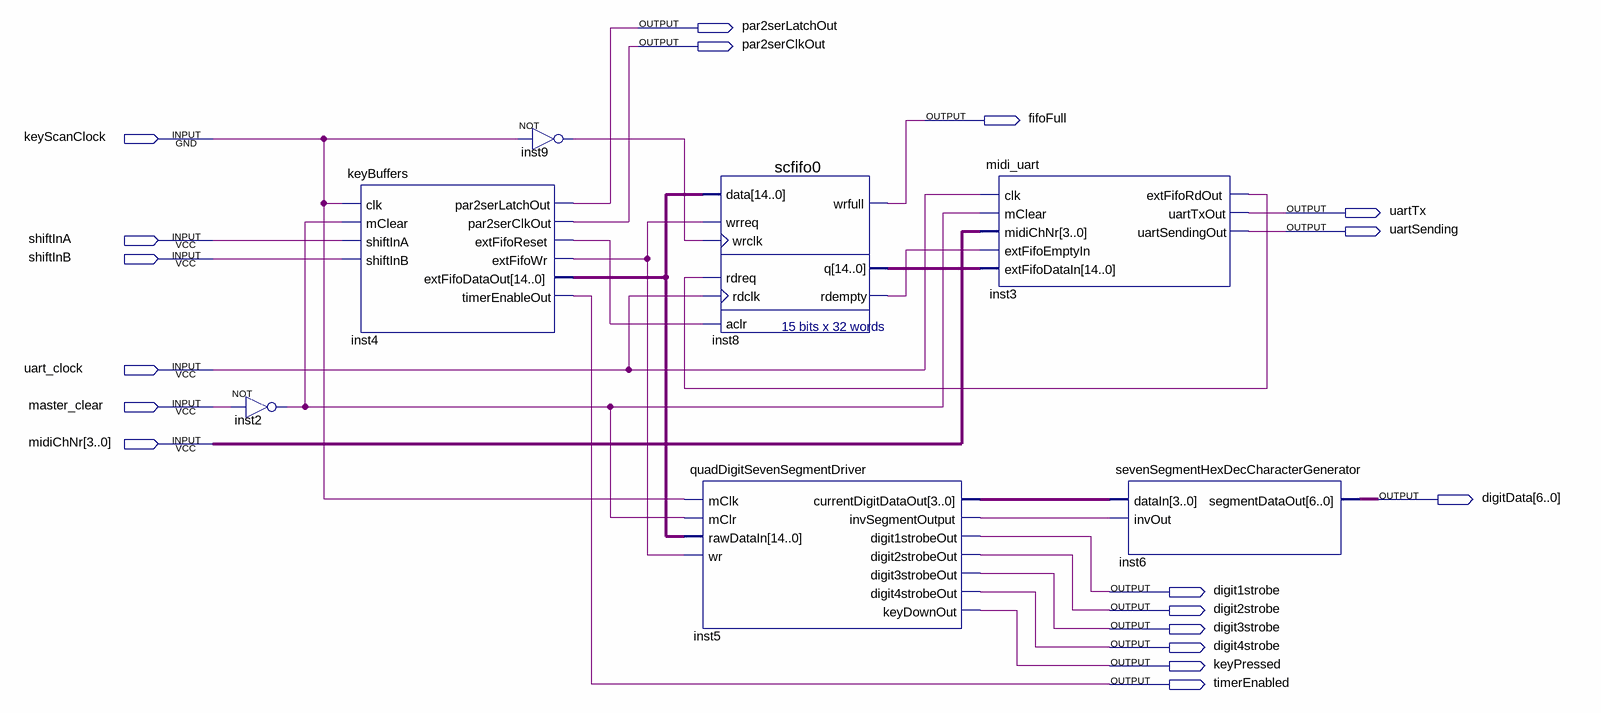
[diagram p0: schematic sheet]
// Quartus schematic Main_with_internal_fifo.bdf as structural Verilog: 7 symbols, 18 pins
module Main_with_internal_fifo (
  input  keyScanClock,
  input  shiftInA,
  input  shiftInB,
  input  uart_clock,
  input  master_clear,
  input  [3:0] midiChNr,
  output par2serLatchOut,
  output par2serClkOut,
  output fifoFull,
  output uartTx,
  output uartSending,
  output [6:0] digitData,
  output digit1strobe,
  output digit2strobe,
  output digit3strobe,
  output digit4strobe,
  output keyPressed,
  output timerEnabled
);

  wire inst2_out, inst3_extfifordout, inst4_extfiforeset, inst4_extfifowr, inst5_invsegmentoutput,
       inst8_rdempty, inst9_out;
  wire [3:0] inst5_currentdigitdataout;
  wire [14:0] inst4_extfifodataout, inst8_q;

  not inst2 (inst2_out, master_clear);
  keyBuffers inst4 (
    .clk(keyScanClock), .mClear(inst2_out), .shiftInA(shiftInA), .shiftInB(shiftInB),
    .par2serLatchOut(par2serLatchOut), .par2serClkOut(par2serClkOut), .extFifoReset(inst4_extfiforeset),
    .extFifoWr(inst4_extfifowr), .extFifoDataOut(inst4_extfifodataout), .timerEnableOut(timerEnabled));
  not inst9 (inst9_out, keyScanClock);
  quadDigitSevenSegmentDriver inst5 (
    .mClk(keyScanClock), .mClr(inst2_out), .rawDataIn(inst4_extfifodataout), .wr(inst4_extfifowr),
    .currentDigitDataOut(inst5_currentdigitdataout), .invSegmentOutput(inst5_invsegmentoutput),
    .digit1strobeOut(digit1strobe), .digit2strobeOut(digit2strobe), .digit3strobeOut(digit3strobe),
    .digit4strobeOut(digit4strobe), .keyDownOut(keyPressed));
  scfifo0 inst8 (
    .data(inst4_extfifodataout), .wrreq(inst4_extfifowr), .wrclk(inst9_out), .rdreq(inst3_extfifordout),
    .rdclk(uart_clock), .aclr(inst4_extfiforeset), .wrfull(fifoFull), .q(inst8_q), .rdempty(inst8_rdempty));
  midi_uart inst3 (
    .clk(uart_clock), .mClear(inst2_out), .midiChNr(midiChNr), .extFifoEmptyIn(inst8_rdempty),
    .extFifoDataIn(inst8_q), .extFifoRdOut(inst3_extfifordout), .uartTxOut(uartTx),
    .uartSendingOut(uartSending));
  sevenSegmentHexDecCharacterGenerator inst6 (
    .dataIn(inst5_currentdigitdataout), .invOut(inst5_invsegmentoutput), .segmentDataOut(digitData));
endmodule
